# EAGLE schematic MystiqueJamma (EAGLE 7.2.0)
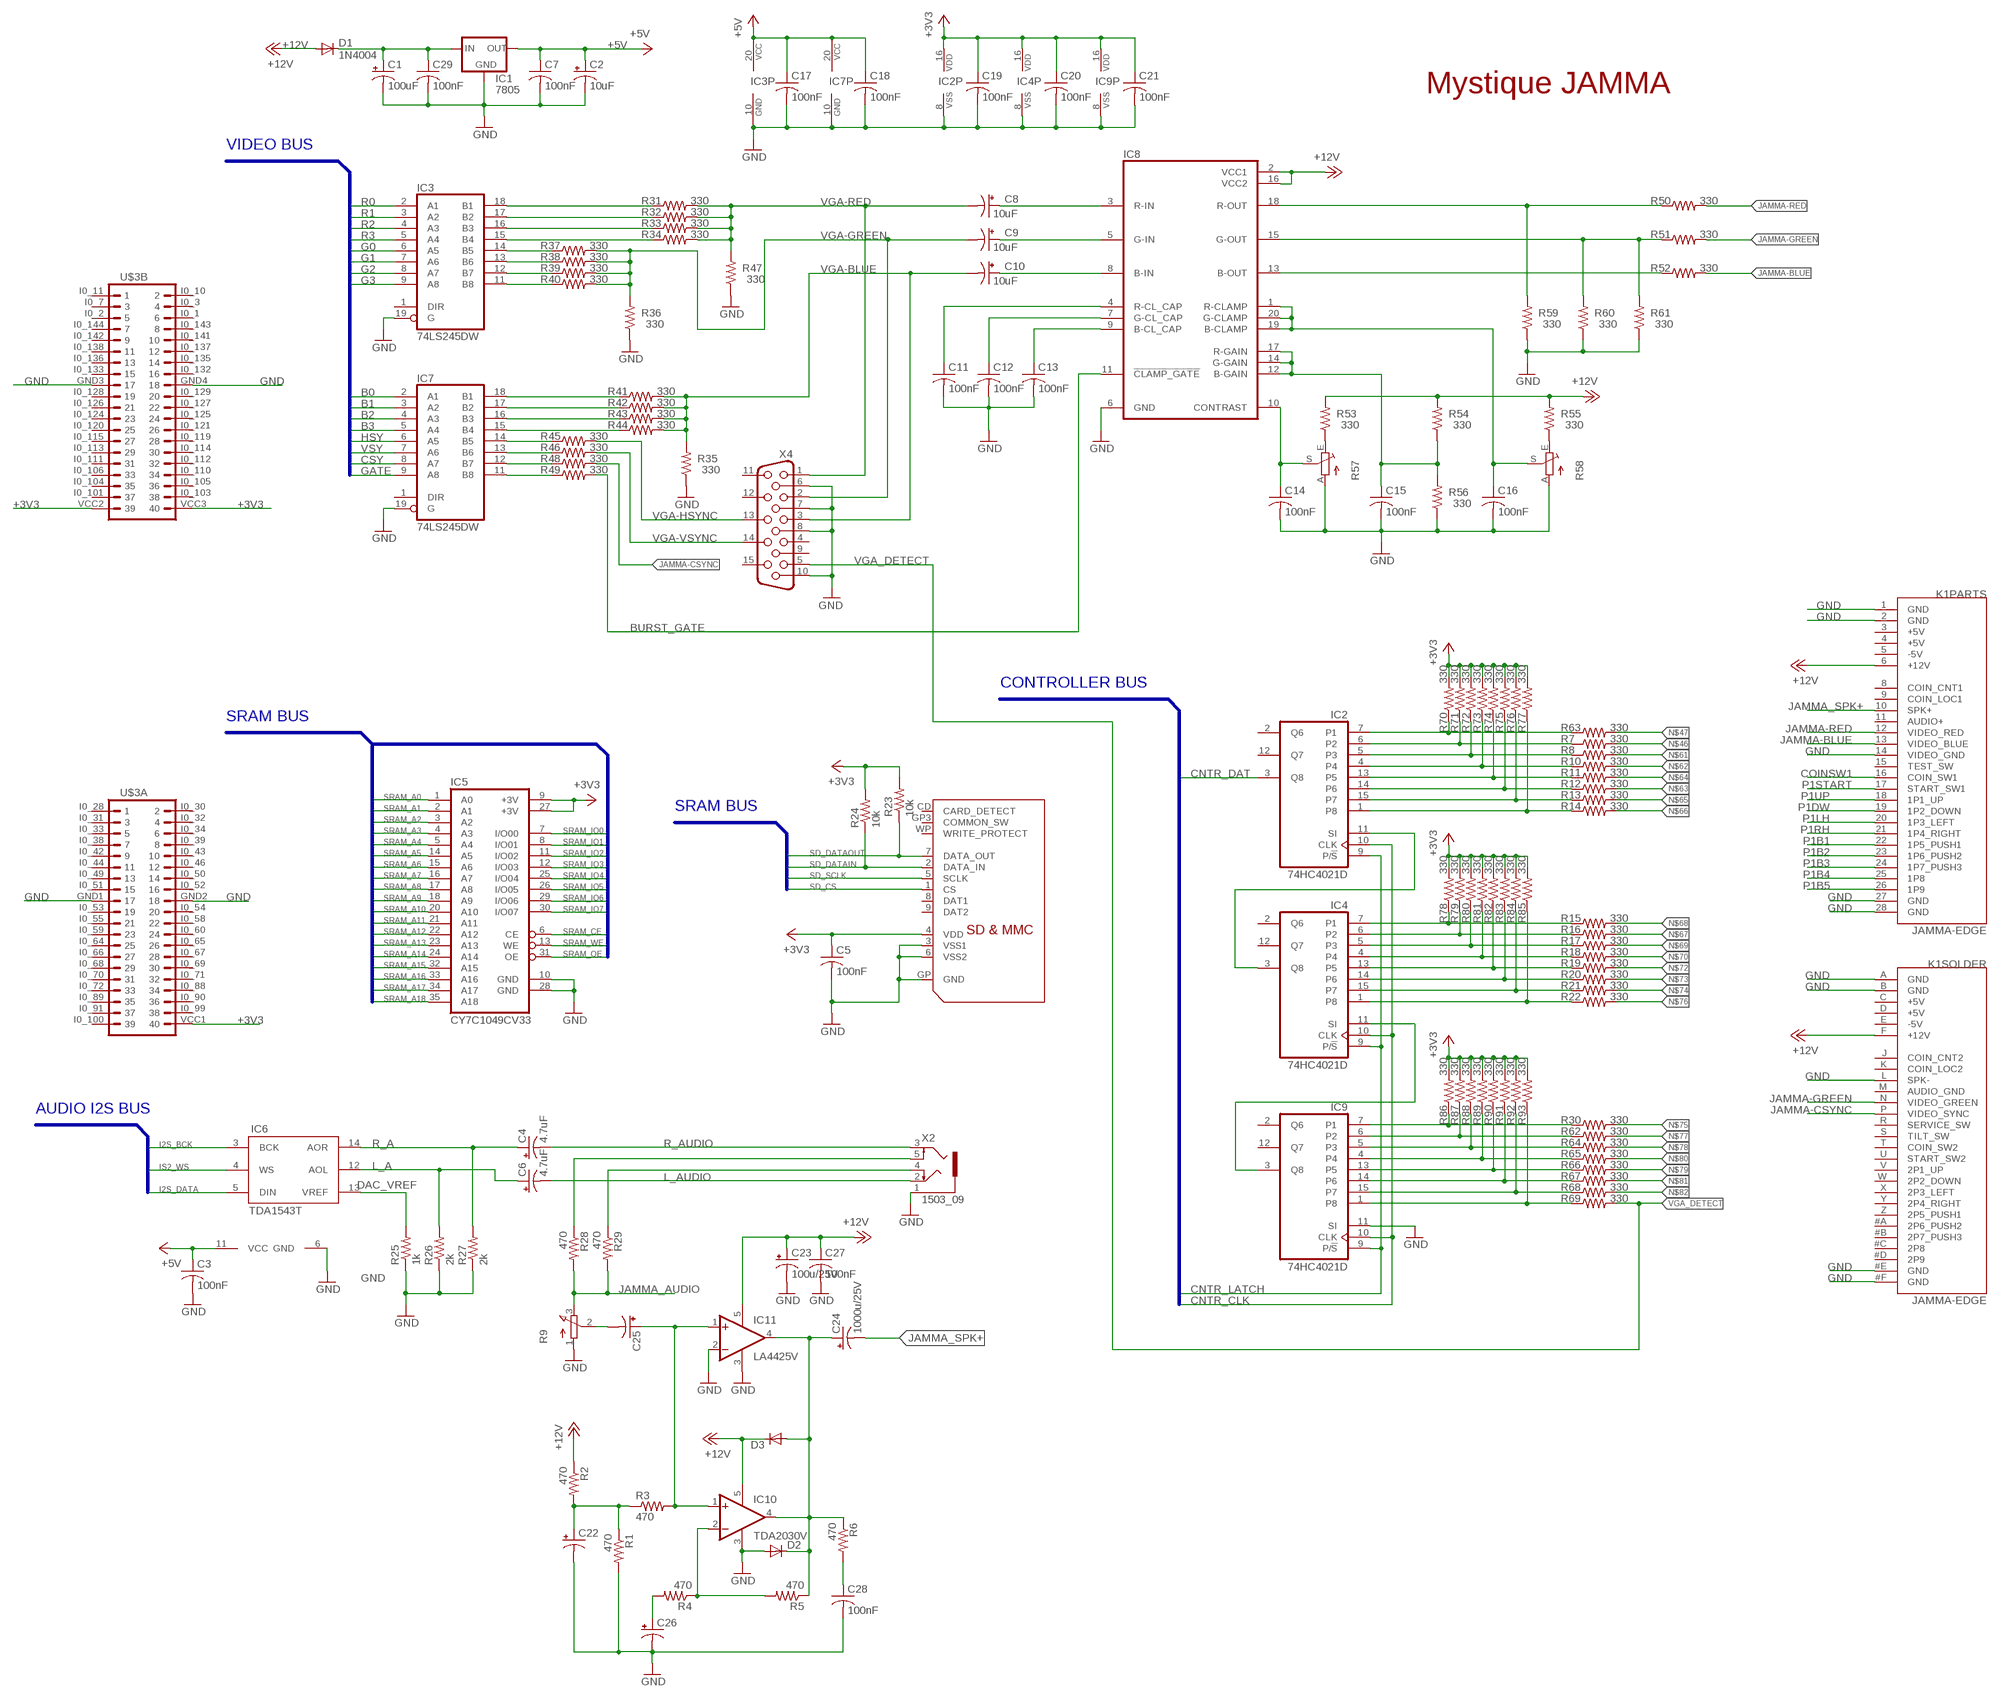
[diagram p0: schematic, sheet 1]

## Parts
C1  100uF  CPOL-USE2.5-5  [E2,5-5]
C2  10uF  CPOL-USE2.5-5  [E2,5-5]
C3  100nF  C-USC1206  [C1206]
C4  4.7uF  CPOL-USE5-6  [E5-6]
C5  100nF  C-USC1206  [C1206]
C6  4.7uF  CPOL-USE5-6  [E5-6]
C7  100nF  C-USC1206  [C1206]
C8  10uF  CPOL-USE2.5-5  [E2,5-5]
C9  10uF  CPOL-USE2.5-5  [E2,5-5]
C10  10uF  CPOL-USE2.5-5  [E2,5-5]
C11  100nF  C-USC1206  [C1206]
C12  100nF  C-USC1206  [C1206]
C13  100nF  C-USC1206  [C1206]
C14  100nF  C-USC1206  [C1206]
C15  100nF  C-USC1206  [C1206]
C16  100nF  C-USC1206  [C1206]
C17  100nF  C-USC1206  [C1206]
C18  100nF  C-USC1206  [C1206]
C19  100nF  C-USC1206  [C1206]
C20  100nF  C-USC1206  [C1206]
C21  100nF  C-USC1206  [C1206]
C22  CPOL-USE2-4  [E2-4]
C23  100u/25V  CPOL-USE3.5-8  [E3,5-8]
C24  1000u/25V  CPOL-USE3.5-8  [E3,5-8]
C25  CPOL-USE2-4  [E2-4]
C26  CPOL-USE2-4  [E2-4]
C27  100nF  C-USC1206  [C1206]
C28  100nF  C-USC1206  [C1206]
C29  100nF  C-USC1206  [C1206]
D1  1N4004  [DO41-10]
D2  DIODE-SOD80C  [SOD80C]
D3  DIODE-SOD80C  [SOD80C]
IC1  7805  V_REG_78XXSINK  [TO220-IGO]
IC2  74HC4021D  4021D  [SO16]
IC3  74LS245DW  [SO20W]
IC4  74HC4021D  4021D  [SO16]
IC5  CY7C1049CV33  [SOJV36-400]
IC6  TDA1543T  [SOIC-16NW]
IC7  74LS245DW  [SO20W]
IC8  TLS1233  [DIL20]
IC9  74HC4021D  4021D  [SO16]
IC10  TDA2030V  [CB360]
IC11  LA4425V  [LA4425]
K1  JAMMA-EDGE  [JAMMA-EDGE]
R1  470  R-US_R1206  [R1206]
R2  470  R-US_R1206  [R1206]
R3  470  R-US_R1206  [R1206]
R4  470  R-US_R1206  [R1206]
R5  470  R-US_R1206  [R1206]
R6  470  R-US_R1206  [R1206]
R7  330  R-US_M1206  [M1206]
R8  330  R-US_M1206  [M1206]
R9  3RP/1610N  [3RP/1610N]
R10  330  R-US_M1206  [M1206]
R11  330  R-US_M1206  [M1206]
R12  330  R-US_M1206  [M1206]
R13  330  R-US_M1206  [M1206]
R14  330  R-US_M1206  [M1206]
R15  330  R-US_M1206  [M1206]
R16  330  R-US_M1206  [M1206]
R17  330  R-US_M1206  [M1206]
R18  330  R-US_M1206  [M1206]
R19  330  R-US_M1206  [M1206]
R20  330  R-US_M1206  [M1206]
R21  330  R-US_M1206  [M1206]
R22  330  R-US_M1206  [M1206]
R23  10k  R-US_R1206  [R1206]
R24  10k  R-US_R1206  [R1206]
R25  1k  R-US_R1206  [R1206]
R26  2k  R-US_R1206  [R1206]
R27  2k  R-US_R1206  [R1206]
R28  470  R-US_R1206  [R1206]
R29  470  R-US_M1206  [M1206]
R30  330  R-US_M1206  [M1206]
R31  330  R-US_M1206  [M1206]
R32  330  R-US_M1206  [M1206]
R33  330  R-US_M1206  [M1206]
R34  330  R-US_M1206  [M1206]
R35  330  R-US_M1206  [M1206]
R36  330  R-US_M1206  [M1206]
R37  330  R-US_M1206  [M1206]
R38  330  R-US_M1206  [M1206]
R39  330  R-US_M1206  [M1206]
R40  330  R-US_M1206  [M1206]
R41  330  R-US_M1206  [M1206]
R42  330  R-US_M1206  [M1206]
R43  330  R-US_M1206  [M1206]
R44  330  R-US_M1206  [M1206]
R45  330  R-US_M1206  [M1206]
R46  330  R-US_M1206  [M1206]
R47  330  R-US_M1206  [M1206]
R48  330  R-US_M1206  [M1206]
R49  330  R-US_M1206  [M1206]
R50  330  R-US_M1206  [M1206]
R51  330  R-US_M1206  [M1206]
R52  330  R-US_M1206  [M1206]
R53  330  R-US_M1206  [M1206]
R54  330  R-US_M1206  [M1206]
R55  330  R-US_M1206  [M1206]
R56  330  R-US_M1206  [M1206]
R57  TRIM_EU-B90P  [SP19L]
R58  TRIM_EU-B90P  [SP19L]
R59  330  R-US_M1206  [M1206]
R60  330  R-US_M1206  [M1206]
R61  330  R-US_M1206  [M1206]
R62  330  R-US_M1206  [M1206]
R63  330  R-US_M1206  [M1206]
R64  330  R-US_M1206  [M1206]
R65  330  R-US_M1206  [M1206]
R66  330  R-US_M1206  [M1206]
R67  330  R-US_M1206  [M1206]
R68  330  R-US_M1206  [M1206]
R69  330  R-US_M1206  [M1206]
R70  330  R-US_M1206  [M1206]
R71  330  R-US_M1206  [M1206]
R72  330  R-US_M1206  [M1206]
R73  330  R-US_M1206  [M1206]
R74  330  R-US_M1206  [M1206]
R75  330  R-US_M1206  [M1206]
R76  330  R-US_M1206  [M1206]
R77  330  R-US_M1206  [M1206]
R78  330  R-US_M1206  [M1206]
R79  330  R-US_M1206  [M1206]
R80  330  R-US_M1206  [M1206]
R81  330  R-US_M1206  [M1206]
R82  330  R-US_M1206  [M1206]
R83  330  R-US_M1206  [M1206]
R84  330  R-US_M1206  [M1206]
R85  330  R-US_M1206  [M1206]
R86  330  R-US_M1206  [M1206]
R87  330  R-US_M1206  [M1206]
R88  330  R-US_M1206  [M1206]
R89  330  R-US_M1206  [M1206]
R90  330  R-US_M1206  [M1206]
R91  330  R-US_M1206  [M1206]
R92  330  R-US_M1206  [M1206]
R93  330  R-US_M1206  [M1206]
U$2  SDMMC06132  [06132]
U$3  C4E6-K""  [E6V33]
X2  1503_09  [1503_09]
X4  HF15H  [HDF15H]

## Nets
+3V3: C5.1 C19.1 C20.1 C21.1 IC2.16(VDD) IC4.16(VDD) IC5.9(+3V) IC5.27(+3V) IC9.16(VDD) R23.2 R24.2 R70.2 R71.2 R72.2 R73.2 R74.2 R75.2 R76.2 R77.2 R78.2 R79.2 R80.2 R81.2 R82.2 R83.2 R84.2 R85.2 R86.2 R87.2 R88.2 R89.2 R90.2 R91.2 R92.2 R93.2 U$2.4(VDD) U$3.VCC1 U$3.VCC2 U$3.VCC3
+5V: C2.+ C3.1 C7.1 C17.1 C18.1 IC1.OUT IC3.20(VCC) IC6.11(VCC) IC7.20(VCC)
+12V: C23.+ C27.1 D1.A D3.C IC8.2(VCC1) IC8.16(VCC2) IC10.5(V+) IC11.5(V+) K1.6(PARTS:+12V) K1.F(SOLDER:+12V) R2.1 R53.2 R54.2 R55.2
B0: IC7.2(A1)
B1: IC7.3(A2)
B2: IC7.4(A3)
B3: IC7.5(A4)
BURST_GATE: IC8.11(!CLAMP_GATE)
CNTR_CLK: IC2.10(CLK) IC4.10(CLK) IC9.10(CLK)
CNTR_DAT: IC2.3(Q8)
CNTR_LATCH: IC2.9(P/!S) IC4.9(P/!S) IC9.9(P/!S)
COINSW1: K1.16(PARTS:COIN_SW1)
CSY: IC7.8(A7)
DAC_VREF: IC6.13(VREF) R25.2
G0: IC3.6(A5)
G1: IC3.7(A6)
G2: IC3.8(A7)
G3: IC3.9(A8)
GATE: IC7.9(A8)
GND: C1.- C2.- C3.2 C5.2 C7.2 C11.2 C12.2 C13.2 C14.2 C15.2 C16.2 C17.2 C18.2 C19.2 C20.2 C21.2 C22.- C23.- C26.- C27.2 C28.2 C29.2 D2.A IC1.GND IC2.8(VSS) IC3.10(GND) IC3.19(G) IC4.8(VSS) IC5.10(GND) IC5.28(GND) IC6.6(GND) IC7.10(GND) IC7.19(G) IC8.6(GND) IC9.8(VSS) IC9.11(SI) IC10.3(GND) IC11.2(-IN) IC11.3(GND) K1.1(PARTS:GND) K1.2(PARTS:GND) K1.14(PARTS:VIDEO_GND) K1.27(PARTS:GND) K1.28(PARTS:GND) K1.#E(SOLDER:GND) K1.#F(SOLDER:GND) K1.A(SOLDER:GND) K1.B(SOLDER:GND) K1.L(SOLDER:SPK-) R1.2 R9.1(A) R25.1 R26.1 R27.1 R35.1 R36.1 R47.1 R56.1 R57.A R58.A R59.1 R60.1 R61.1 U$2.3(VSS1) U$2.6(VSS2) U$2.GP(GND) U$3.GND1 U$3.GND2 U$3.GND3 U$3.GND4 X2.1 X4.6 X4.7 X4.8 X4.10
HSY: IC7.6(A5)
I2S_BCK: IC6.3(BCK)
I2S_DATA: IC6.5(DIN)
IS2_WS: IC6.4(WS)
JAMMA-BLUE: K1.13(PARTS:VIDEO_BLUE) R52.2
JAMMA-CSYNC: K1.P(SOLDER:VIDEO_SYNC)
JAMMA-GREEN: K1.N(SOLDER:VIDEO_GREEN) R51.2
JAMMA-RED: K1.12(PARTS:VIDEO_RED) R50.2
JAMMA_AUDIO: R9.3(E) R28.2 R29.2
JAMMA_SPK+: C24.- K1.10(PARTS:SPK+)
L_A: C6.+ IC6.12(AOL) R26.2
L_AUDIO: C6.- X2.2
LAA: R29.1 X2.4
N$1: IC3.17(B2) R32.1
N$2: C1.+ C29.1 D1.C IC1.IN
N$3: IC3.18(B1) R31.1
N$4: C8.+ IC8.3(R-IN)
N$5: C9.+ IC8.5(G-IN)
N$6: C10.+ IC8.8(B-IN)
N$7: IC3.16(B3) R33.1
N$8: IC3.15(B4) R34.1
N$9: IC3.14(B5)
N$10: IC3.13(B6)
N$11: IC3.12(B7)
N$12: IC3.11(B8)
N$13: IC7.17(B2)
N$14: IC7.18(B1)
N$15: IC7.16(B3)
N$16: IC7.15(B4)
N$17: IC7.14(B5)
N$18: IC7.13(B6)
N$19: IC7.12(B7)
N$20: IC7.11(B8)
N$21: C16.1 IC8.1(R-CLAMP) IC8.19(B-CLAMP) IC8.20(G-CLAMP) R58.S
N$22: C11.1 IC8.4(R-CL_CAP)
N$23: C12.1 IC8.7(G-CL_CAP)
N$24: C13.1 IC8.9(B-CL_CAP)
N$25: IC8.18(R-OUT) R50.1 R59.2
N$26: IC8.15(G-OUT) R51.1 R60.2 R61.2
N$27: IC8.13(B-OUT) R52.1
N$28: C14.1 IC8.10(CONTRAST) R57.S
N$29: R53.1 R57.E
N$30: IC2.7(P1) R63.1
N$31: R55.1 R58.E
N$32: IC2.6(P2) R7.1
N$33: IC2.5(P3) R8.1
N$34: C15.1 IC8.12(B-GAIN) IC8.14(G-GAIN) IC8.17(R-GAIN) R54.1 R56.2
N$35: IC2.4 R10.1
N$36: IC2.13(P5) R11.1
N$37: IC2.14(P6) R12.1
N$38: IC2.15(P7) R13.1
N$39: IC2.1(P8) R14.1
N$40: IC4.7(P1)
N$41: IC4.6(P2)
N$42: IC4.5(P3)
N$43: IC4.4
N$44: IC4.13(P5)
N$45: C22.+ R1.1 R2.2 R3.1
N$46: R7.2
N$47: R63.2
N$48: IC4.14(P6)
N$49: IC4.15(P7)
N$50: IC4.1(P8)
N$51: IC9.7(P1)
N$52: IC9.6(P2)
N$53: IC9.5(P3)
N$54: IC9.4
N$55: IC9.13(P5)
N$56: IC9.14(P6)
N$57: IC9.15(P7)
N$58: IC9.1(P8)
N$59: C28.1 R6.2
N$60: C26.+ R4.2
N$61: R8.2
N$62: R10.2
N$63: R12.2
N$64: R11.2
N$65: R13.2
N$66: R14.2
N$71: IC10.2(-IN) R4.1 R5.2
N$88: IC2.11(SI) IC4.3(Q8)
N$89: IC4.11(SI) IC9.3(Q8)
N$91: C25.- R9.2(S)
N$92: C25.+ IC10.1(+IN) IC11.1(+IN) R3.2
N$93: C24.+ D2.C D3.A IC10.4(OUT) IC11.4(OUT) R5.1 R6.1
P1B1: K1.22(PARTS:1P5_PUSH1)
P1B2: K1.23(PARTS:1P6_PUSH2)
P1B3: K1.24(PARTS:1P7_PUSH3)
P1B4: K1.25(PARTS:1P8)
P1B5: K1.26(PARTS:1P9)
P1DW: K1.19(PARTS:1P2_DOWN)
P1LH: K1.20(PARTS:1P3_LEFT)
P1RH: K1.21(PARTS:1P4_RIGHT)
P1START: K1.17(PARTS:START_SW1)
P1UP: K1.18(PARTS:1P1_UP)
R0: IC3.2(A1)
R1: IC3.3(A2)
R2: IC3.4(A3)
R3: IC3.5(A4)
R_A: C4.+ IC6.14(AOR) R27.2
R_AUDIO: C4.- X2.3
RAA: R28.1 X2.5
SD_CS: U$2.1(CS)
SD_DATAIN: R24.1 U$2.2(DATA_IN)
SD_DATAOUT: R23.1 U$2.7(DATA_OUT)
SD_SCLK: U$2.5(SCLK)
SRAM_A0: IC5.1(A0)
SRAM_A1: IC5.2(A1)
SRAM_A2: IC5.3(A2)
SRAM_A3: IC5.4(A3)
SRAM_A4: IC5.5(A4)
SRAM_A5: IC5.14(A5)
SRAM_A6: IC5.15(A6)
SRAM_A7: IC5.16(A7)
SRAM_A8: IC5.17(A8)
SRAM_A9: IC5.18(A9)
SRAM_A10: IC5.20(A10)
SRAM_A11: IC5.21(A11)
SRAM_A12: IC5.22(A12)
SRAM_A13: IC5.23(A13)
SRAM_A14: IC5.24(A14)
SRAM_A15: IC5.32(A15)
SRAM_A16: IC5.33(A16)
SRAM_A17: IC5.34(A17)
SRAM_A18: IC5.35(A18)
SRAM_CE: IC5.6(CE)
SRAM_IO0: IC5.7(I/O00)
SRAM_IO1: IC5.8(I/O01)
SRAM_IO2: IC5.11(I/O02)
SRAM_IO3: IC5.12(I/O03)
SRAM_IO4: IC5.25(I/O04)
SRAM_IO5: IC5.26(I/O05)
SRAM_IO6: IC5.29(I/O06)
SRAM_IO7: IC5.30(I/O07)
SRAM_OE: IC5.31(OE)
SRAM_WE: IC5.13(WE)
VGA-BLUE: C10.- R35.2 X4.3
VGA-GREEN: C9.- R36.2 X4.2
VGA-HSYNC: X4.13
VGA-RED: C8.- R31.2 R32.2 R33.2 R34.2 R47.2 X4.1
VGA-VSYNC: X4.14
VGA_DETECT: X4.5
VSY: IC7.7(A6)
Unconnected: IC2.2(Q6) IC2.12(Q7) IC3.1(DIR) IC4.2(Q6) IC4.12(Q7) IC7.1(DIR) IC9.2(Q6) IC9.12(Q7) K1.8(PARTS:COIN_CNT1) K1.9(PARTS:COIN_LOC1) K1.11(PARTS:AUDIO+) K1.15(PARTS:TEST_SW) K1.#A(SOLDER:2P6_PUSH2) K1.#B(SOLDER:2P7_PUSH3) K1.#C(SOLDER:2P8) K1.#D(SOLDER:2P9) K1.J(SOLDER:COIN_CNT2) K1.K(SOLDER:COIN_LOC2) K1.M(SOLDER:AUDIO_GND) K1.R(SOLDER:SERVICE_SW) K1.S(SOLDER:TILT_SW) K1.T(SOLDER:COIN_SW2) K1.U(SOLDER:START_SW2) K1.V(SOLDER:2P1_UP) K1.W(SOLDER:2P2_DOWN) K1.X(SOLDER:2P3_LEFT) K1.Y(SOLDER:2P4_RIGHT) K1.Z(SOLDER:2P5_PUSH1) R15.1 R15.2 R16.1 R16.2 R17.1 R17.2 R18.1 R18.2 R19.1 R19.2 R20.1 R20.2 R21.1 R21.2 R22.1 R22.2 R30.1 R30.2 R37.1 R37.2 R38.1 R38.2 R39.1 R39.2 R40.1 R40.2 R41.1 R41.2 R42.1 R42.2 R43.1 R43.2 R44.1 R44.2 R45.1 R45.2 R46.1 R46.2 R48.1 R48.2 R49.1 R49.2 R62.1 R62.2 R64.1 R64.2 R65.1 R65.2 R66.1 R66.2 R67.1 R67.2 R68.1 R68.2 R69.1 R69.2 R70.1 R71.1 R72.1 R73.1 R74.1 R75.1 R76.1 R77.1 R78.1 R79.1 R80.1 R81.1 R82.1 R83.1 R84.1 R85.1 R86.1 R87.1 R88.1 R89.1 R90.1 R91.1 R92.1 R93.1 U$2.8(DAT1) U$2.9(DAT2) U$2.CD(CARD_DETECT) U$2.GP3(COMMON_SW) U$2.WP(WRITE_PROTECT) U$3.I0_1 U$3.I0_2 U$3.I0_3 U$3.I0_7 U$3.I0_10 U$3.I0_11 U$3.I0_28 U$3.I0_30 U$3.I0_31 U$3.I0_32 U$3.I0_33 U$3.I0_34 U$3.I0_38 U$3.I0_39 U$3.I0_42 U$3.I0_43 U$3.I0_44 U$3.I0_46 U$3.I0_49 U$3.I0_50 U$3.I0_51 U$3.I0_52 U$3.I0_53 U$3.I0_54 U$3.I0_55 U$3.I0_58 U$3.I0_59 U$3.I0_60 U$3.I0_64 U$3.I0_65 U$3.I0_66 U$3.I0_67 U$3.I0_68 U$3.I0_69 U$3.I0_70 U$3.I0_71 U$3.I0_72 U$3.I0_88 U$3.I0_89 U$3.I0_90 U$3.I0_91 U$3.I0_99 U$3.I0_100 U$3.I0_101 U$3.I0_103 U$3.I0_104 U$3.I0_105 U$3.I0_106 U$3.I0_110 U$3.I0_111 U$3.I0_112 U$3.I0_113 U$3.I0_114 U$3.I0_115 U$3.I0_119 U$3.I0_120 U$3.I0_121 U$3.I0_124 U$3.I0_125 U$3.I0_126 U$3.I0_127 U$3.I0_128 U$3.I0_129 U$3.I0_132 U$3.I0_133 U$3.I0_135 U$3.I0_136 U$3.I0_137 U$3.I0_138 U$3.I0_141 U$3.I0_142 U$3.I0_143 U$3.I0_144 X4.4 X4.9 X4.11 X4.12 X4.15

## Buses
R[0..3],G[0..3],B[0..3],HSY,VSY,CSY,GATE
SRAM_A[0..18],SRAM_IO[0..7],SRAM_CE,SRAM_WE,SRAM_OE
SD_DATAOUT,SD_DATAIN,SD_SCLK,SD_CS
I2S_BCK,IS2_WS,I2S_DATA
CNTR_CLK,CNTR_DAT,CNTR_LATCH

## Notes on the sheet
- Mystique JAMMA
- VIDEO BUS
- CONTROLLER BUS
- SRAM BUS
- SRAM BUS
- AUDIO I2S BUS

## Power pins joined to a net without a drawn wire
+5V: K1.3(PARTS:+5V) K1.4(PARTS:+5V) K1.C(SOLDER:+5V) K1.D(SOLDER:+5V)
-5V: K1.5(PARTS:-5V) K1.E(SOLDER:-5V)

## Library data of the parts
C1 C2 C8-C10 = rcl-2:CPOL-US: POLARIZED CAPACITOR, American symbol
C3 C5 C7 C11-C21 C27-C29 = adafruit:C-US: CAPACITOR, American symbol
C4 C6 = adafruit:CPOL-US: POLARIZED CAPACITOR, American symbol
C22-C26 = rcl:CPOL-US: POLARIZED CAPACITOR, American symbol
D1 = adafruit:1N4004: DIODE General purpose 1N400x type rectifier (With bigger pads) http://www.ladyada.net/library/pcb/eaglelibrary.html
D2 D3 = diode:DIODE-: DIODE
IC1 = SparkFun:V_REG_78XX: Voltage Regulator Standard 7805 5V regulator. IGO (Input Ground Output). Spark Fun Electronics SKU : COM-00107
IC2 IC4 IC9 = 40xx:4021: 8-bit static SHIFT REGISTER
IC3 IC7 = 74xx-us:74*245: Octal BUS TRANSCEIVER, 3-state
IC5 = memory-sram:CY7C1049CV33: 4-Mbit (512K x 8) Static RAM Source: CYPRESS cy7c1049cv33_8.pdf
IC6 = TDA1543:TDA1543: TDA1543 I2S DAC
IC8 = TLS1233:TLS1233: The TLS1233 is a 100-MHz wide-band video preamplifier system intended for mid-to-high-resolution RGB (red-green-blue) color monitors. Each video amplifier (R, G, and B) contains a gain set for adjusting maximum system gain (AV = 7.8 V/V). The TLS1233 provides digital level-operated contrast, brightness, and gain adjustment control. All the control inputs offer high input impedance and an operation range from 0 V to 4 V for easy interface to the serial digital buses.
IC10 = linear:TDA2030: Power OP AMP
IC11 = LA4425:LA4425: Power OP AMP
K1 = JAMMA:JAMMA-EDGE
R1-R8 R10-R56 R59-R93 = adafruit:R-US_: RESISTOR, American symbol
R9 = pot:3RP/1610N: 16mm Potentiometer one level Source: http://www.alphapotentiometers.net/html/16mm_pot_2.html
R57 R58 = pot:TRIM_EU-: POTENTIOMETER
U$2 = adafruit:SDMMC: SD MMC Card holder 4UCON part #06132 - easy to solder
U$3 = FPGA-BOARD:C4E6-K: FPGA board size C4E6 - Cyclone IV
X2 = con-lumberg:1503_09: Jack connectors according to JISC 6560, 3.5 mm Klinkeneinbaukupplung nach JISC 6560, 3,5 mm, 3-polig/ stereo, abgewinkelte Ausführung, mit 2 Öffnern und Lötaugen, für Leiterplatten Rückseitenmontage Source: http://www.lumberg.com/Produkte/PDFs/1503_09.pdf; OC_FARNELL: 1243244; OC_NEWARK: unknown
X4 = con-subd:HF15: SUB-D; OC_FARNELL: unknown; OC_NEWARK: unknown